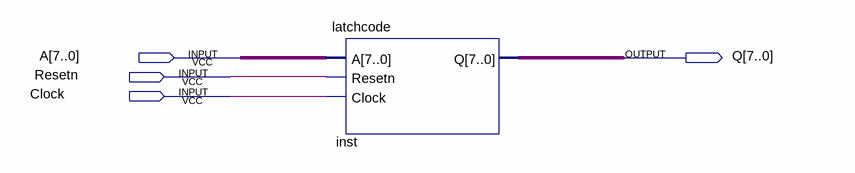
[diagram p0: schematic sheet]
// Quartus schematic latchschem.bdf as structural Verilog: 1 symbols, 4 pins
module latchschem (
  input  [7:0] A,
  input  Resetn,
  input  Clock,
  output [7:0] Q
);

  latchcode inst (.A(A), .Resetn(Resetn), .Clock(Clock), .Q(Q));
endmodule
